# Altium schematic sheet MCU0.SchDoc
size A4; SheetNumber: 2; SheetTotal: 2
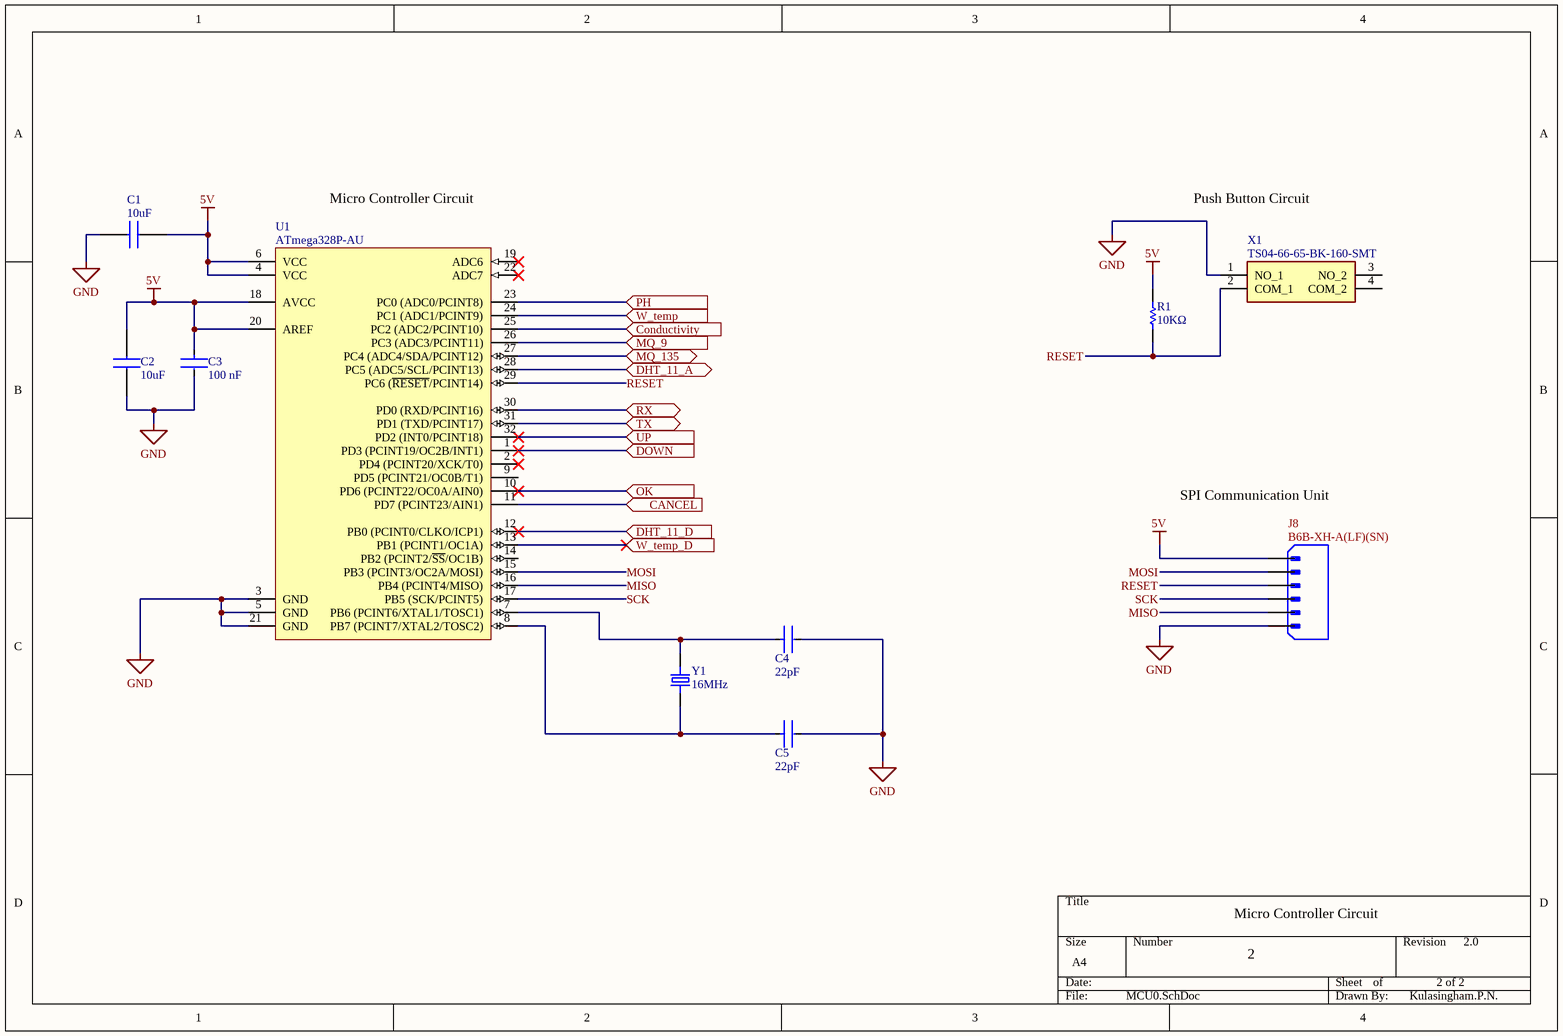
[diagram p0: MCU0.SchDoc]

## Parts
C1  Capacitance: 10uF  [CAPC3216X180N]  (hidden comment: C1206C106K8RAC)
C2  Capacitance: 10uF  [CAPC3216X180N]  (hidden comment: C1206C106K8RAC)
C3  value 100 nF  [FP-CC1206-1_25-MFG]  (hidden comment: CC1206KRX7R9BB104)
C4  Capacitance: 22pF  [FP-1206-L_3_2_0_2-W_1_6_0-IPC_C]  (hidden comment: 12065A220JAT2A)
C5  Capacitance: 22pF  [FP-1206-L_3_2_0_2-W_1_6_0-IPC_C]  (hidden comment: 12065A220JAT2A)
J8  B6B-XH-A(LF)(SN)  [JST_B6B-XH-A(LF)(SN)]
R1  Resistance: 10KΩ  [RESC3116X65X40ML10T20]  (hidden comment: RC1206FR-0710KL)
U1  ATmega328P-AU  [32A_L]
X1  TS04-66-65-BK-160-SMT  [TS046665BK160SMT]
Y1  value 16MHz  [Oscillator]  (hidden comment: ECS-160-20-4_1)

## Ports
CANCEL (in, see Main0[2B]), Conductivity (in, see Main0[2C]), DHT_11_A (bidir, see Main0[2C]), DHT_11_D (in, see Main0[2C]), DOWN (in, see Main0[2B]), MQ_9 (in, see Main0[2C]), MQ_135 (bidir, see Main0[2C]), OK (in, see Main0[2B]), PH (in, see Main0[2C]), RX (bidir, see Main0[3C]), TX (bidir, see Main0[3C]), UP (in, see Main0[2B]), W_temp (in, see Main0[2C]), W_temp_D (in, see Main0[2C])

## Nets
5V: C1.2 C2.2 C3.1 J8.1(M2) R1.2 U1.4(VCC) U1.6(VCC) U1.18(AVCC) U1.20(AREF)
GND: C1.1 C2.1 C3.2 C4.2 C5.2 J8.6(M1) U1.3(GND) U1.5(GND) U1.21(GND) X1.1(NO_1)
CANCEL: U1.11(PD7_(PCINT23/AIN1)) ; port CANCEL
Conductivity: U1.25(PC2_(ADC2/PCINT10)) ; port Conductivity
DHT_11_A: U1.28(PC5_(ADC5/SCL/PCINT13)) ; port DHT_11_A
DHT_11_D: U1.12(PB0_(PCINT0/CLKO/ICP1)) ; port DHT_11_D
DOWN: U1.1(PD3_(PCINT19/OC2B/INT1)) ; port DOWN
MISO: J8.5 U1.16(PB4_(PCINT4/MISO))
MOSI: J8.2 U1.15(PB3_(PCINT3/OC2A/MOSI))
MQ_9: U1.26(PC3_(ADC3/PCINT11)) ; port MQ_9
MQ_135: U1.27(PC4_(ADC4/SDA/PCINT12)) ; port MQ_135
OK: U1.10(PD6_(PCINT22/OC0A/AIN0)) ; port OK
PH: U1.23(PC0_(ADC0/PCINT8)) ; port PH
RESET: J8.3 R1.1 U1.29(PC6_(~{RESET}/PCINT14)) X1.2(COM_1)
RX: U1.30(PD0_(RXD/PCINT16)) ; port RX
SCK: J8.4 U1.17(PB5_(SCK/PCINT5))
TX: U1.31(PD1_(TXD/PCINT17)) ; port TX
UP: U1.32(PD2_(INT0/PCINT18)) ; port UP
W_temp: U1.24(PC1_(ADC1/PCINT9)) ; port W_temp
W_temp_D: U1.13(PB1_(PCINT1/OC1A)) ; port W_temp_D
NetC4_1: C4.1 U1.7(PB6_(PCINT6/XTAL1/TOSC1)) Y1.2
NetC5_1: C5.1 U1.8(PB7_(PCINT7/XTAL2/TOSC2)) Y1.1

Not connected (* = marked no-connect by the designer): U1 2(PD4_(PCINT20/XCK/T0))* 9(PD5_(PCINT21/OC0B/T1)) 14(PB2_(PCINT2/~{SS}/OC1B)) 19(ADC6)* 22(ADC7)*; X1 3(NO_2) 4(COM_2)

## Notes on the sheet
- Micro Controller Circuit
- Push Button Circuit
- SPI Communication Unit
- 2
- 2 of 2
- 2.0
- Kulasingham.P.N.

## Library data of the parts
C1 C2 = C1206C106K8RAC: Multilayer Ceramic Capacitors MLCC - SMD/SMT 10V 10uF X7R 1206 0.1; Manufacturer_Name: KEMET; Geometry.Height: 1.8mm; Mouser Part Number: 80-C1206C106K8RAC; Mouser Price/Stock: https://www.mouser.co.uk/ProductDetail/KEMET/C1206C106K8RAC?qs=IIhARexJuViDIgySPNv42g%3D%3D; Manufacturer_Part_Number: C1206C106K8RAC; Datasheet Link: https://www.mouser.in/datasheet/2/212/KEM_C1002_X7R_SMD-1102033.pdf
C3 = CMP-03422-000842-1: CAP CER 0.1UF 50V X7R 1206; Manufacturer: Yageo; Automotive Grade: NA; Tolerance: 0.1; Material: Ceramic; Temperature Coefficient: 15%; Temperature Characteristic: X7R; Device Class L1: Passive Components; Lead Free: Yes; Octopart: https://octopart.com/cc1206krx7r9bb104-yageo-39467816; Category: Cap; Temperature Range Low: -55°C; Device Class L3: Ceramic Capacitors; Voltage Rating: 50 V; Temperature Range High: +125°C; Device Class L2: Capacitors; RoHS: TRUE; Package: CC1206-1.25; Footprint Url: http://www.yageo.com/exep/pages/download/literatures/UPY-C_GEN_24.pdf; ComponentLink2Description: Datasheet; Temperature: -55°C to +125°C; Capacitance: 100 nF; Digikey Description: CAP CER 0.1UF 50V X7R 1206; Height: 1.45mm; Automotive: No; Mouser Description: Multilayer Ceramic Capacitors MLCC - SMD/SMT 100nF 50V X7R 10%; ComponentLink2URL: http://www.yageo.com/documents/recent/UPY-NP0X7R_HV_1KV-to-3KV_11.pdf; Manufacturer Part Number: CC1206KRX7R9BB104
C4 C5 = CMP-1037-00977-2: General Purpose Ceramic Capacitor, 1206, 22pF, 5%, NP0, 30ppm/°C, 50V; Dielectric: C0G; Construction: Flat; Thickness: 0.037inch; Width: 0.063inch; Min Operating Temperature: -55°C; Contact Plating: Tin; Radiation Hardening: No; Depth: 1.6mm; REACH SVHC: No SVHC; Voltage: 50V; Series: -; Max Operating Temperature: 125°C; RoHS Compliant: Yes; Voltage Rating (DC): 50V; Packaging: Tape and Reel; Lead Free: Lead Free; Termination: SMD/SMT; Number of Pins: 2; Case Code (Metric): 3216; Tolerance: 5%; Voltage Rating: 50V; Mount: Surface Mount; Length: 3.2mm; Case/Package: 1206; Package Quantity: 1; Case Code (Imperial): 1206
J8 = B6B-XH-A(LF)(SN): Connector Header Through Hole 6 position 0.098 (2.50mm); MF: JST Sales; SnapEDA_Link: https://www.snapeda.com/parts/B6B-XH-A(LF)(SN)/JST+Sales+America+Inc./view-part/?ref=snap; Package: None; Value: *; MP: B6B-XH-A(LF)(SN); Check_prices: https://www.snapeda.com/parts/B6B-XH-A(LF)(SN)/JST+Sales+America+Inc./view-part/?ref=eda
R1 = CMP-1014-00623-2: Chip Resistor, 10 KOhm, +/- 1%, 0.25 W, -55 to 155 degC, 1206 (3216 Metric), RoHS, Tape and Reel; Manufacturer: Yageo; Voltage Rating: 200V; Temperature Coefficient: 100ppm/degreesC; Power Rating: 250mW; Packaging: TapeandReel; Termination: SMD/SMT; REACH SVHC: Unknown; Tolerance: 1%; Height: 0.55mm; Composition: ThickFilm; Max Operating Temperature: 155degC; Datasheet Version: Rev. 5, 10/2016; Lead Free: LeadFree; Case Code (Metric): 3216; Depth: 1.6mm; Package Quantity: 5000; RoHSCompliant: true; Military Standard: Not; Case/Package: 1206; Case Code (Imperial): 1206; Min Operating Temperature: -55degC; Datasheet URL: http://www.yageo.com/NewPortal/yageodocoutput?fileName=/pdf/R-Chip/PYu-RC_Group_51_RoHS_L_5.pdf; Length: 3.1mm; Manufacturer URL: http://www.yageo.com/; Package Reference: 1206.0; Width: 1.6mm; Package Description: 2-Pin Surface Mount Device, Body 3.1 x 1.6 mm
U1 = CMP-0095-00269-2: 8-bit AVR Microcontroller, 32KB Flash, 1KB EEPROM, 2KB SRAM, 32-pin TQFP, Industrial Grade (-40°C to 85°C); PackageDescription: 32-Lead, 7x7x1.0 mm Body, 0.8mm Lead Pitch, Thin Profile Plastic Quad Flat Package (TQFP); DatasheetVersion: revD, May-2011; RevisionNote: DatasheetVersion & PackageVersion updated. URLs added.; ComponentLink1URL: http://www.atmel.com/; ComponentLink2Description: ATmega48A/48PA/88A/88PA/168A/168PA/328/328P Datasheet; Code_JEDEC: MS-026-ABA; ComponentLink1Description: Manufacturer URL; PackageReference: 32A; ComponentLink3Description: ATmega48A/48PA/88A/88PA/168A/168PA/328/328P Summary; ComponentLink2URL: http://www.atmel.com/dyn/resources/prod_documents/doc8271.pdf; PackageVersion: revC, Oct-2010; ComponentLink3URL: http://www.atmel.com/dyn/resources/prod_documents/8271S.pdf
X1 = TS04-66-65-BK-160-SMT: Tactile Switches 6 x 6 mm, 6.5 mm Act Height, 160 gf, Black, Surface Mount, SPST,; Manufacturer_Name: CUI Devices; Geometry.Height: 6.7mm; Mouser Part Number: 179-TS046665BK160SMT; Mouser Price/Stock: https://www.mouser.co.uk/ProductDetail/CUI-Devices/TS04-66-65-BK-160-SMT?qs=A6eO%252BMLsxmTgRLoTHWtDYQ%3D%3D; Manufacturer_Part_Number: TS04-66-65-BK-160-SMT; Datasheet Link: https://www.cuidevices.com/product/resource/ts04.pdf
Y1 = ECS-160-20-4_1: Package: None; Price: None; MP: ECS-160-20-4; Availability: Unavailable; Parameter 1: *